# Altium schematic sheet PMTControl.SchDoc
size 297 x 209 mm; SheetNumber: 4; SheetTotal: 4; swcgroup: FabLabs; Org: Sainsbury Wellcome Centre; Add1: 25 Howland Street; Add2: London; Add3: W1T 4JG; WebAddress: www.sainsburywellcome.org; SheetSize: A4; SheetName: PMT Output Level/ Control Input Voltage
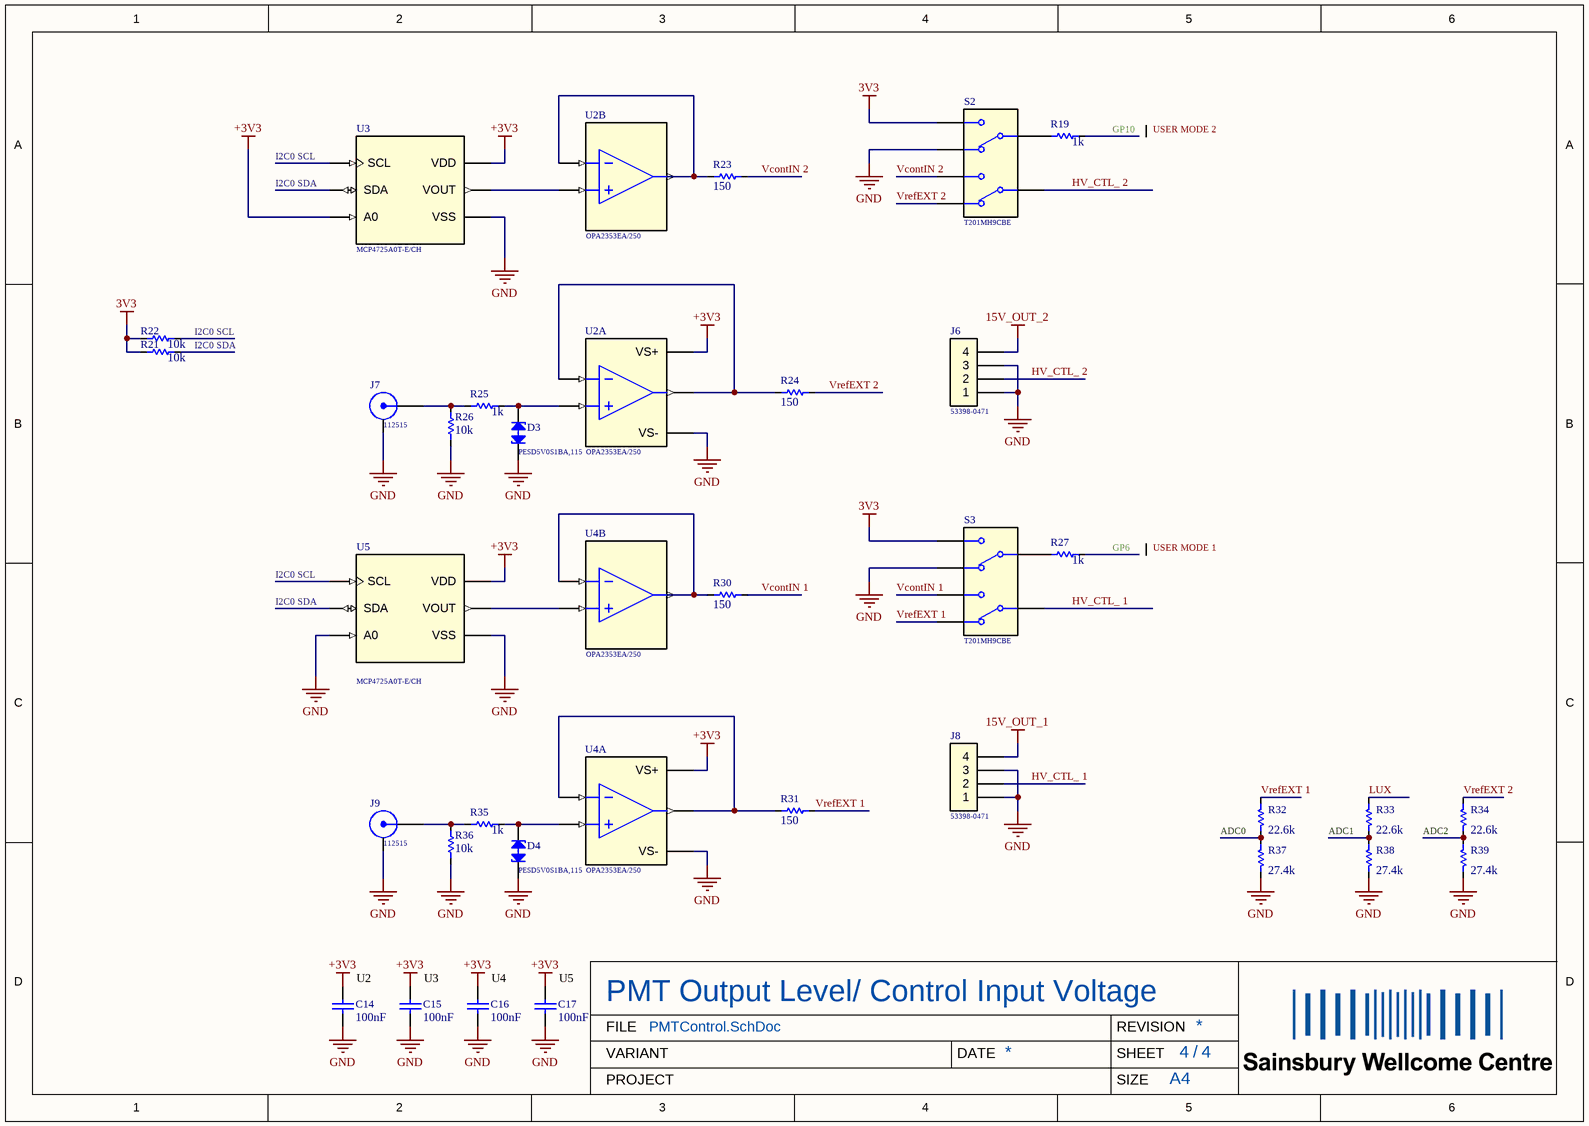
[diagram p0: PMTControl.SchDoc]

## Parts
C14  value 100nF  [FP-GRM188-0_1-e0_2_0_5-IPC_B]  (hidden comment: C0603-100nF-100V-10%-X7R)
C15  value 100nF  [FP-GRM188-0_1-e0_2_0_5-IPC_B]  (hidden comment: C0603-100nF-100V-10%-X7R)
C16  value 100nF  [FP-GRM188-0_1-e0_2_0_5-IPC_B]  (hidden comment: C0603-100nF-100V-10%-X7R)
C17  value 100nF  [FP-GRM188-0_1-e0_2_0_5-IPC_B]  (hidden comment: C0603-100nF-100V-10%-X7R)
D3  PESD5V0S1BA,115  [FP-SOD323-CA-IPC_B]
D4  PESD5V0S1BA,115  [FP-SOD323-CA-IPC_B]
J6  53398-0471  [FP-533980471-MFG]
J7  112515  [AMP_112515]
J8  53398-0471  [FP-533980471-MFG]
J9  112515  [AMP_112515]
R19  value 1k  [FP-CPF0603-IPC_B]  (hidden comment: R0603-1k-1/16W-0.1%)
R21  value 10k  [FP-CPF0603-IPC_B]  (hidden comment: R0603-10k-1/16W-0.1%)
R22  value 10k  [FP-CPF0603-IPC_B]  (hidden comment: R0603-10k-1/16W-0.1%)
R23  value 150  [FP-CPF0603-IPC_B]  (hidden comment: R0603-150R-1/16W-0.1%)
R24  value 150  [FP-CPF0603-IPC_B]  (hidden comment: R0603-150R-1/16W-0.1%)
R25  value 1k  [FP-CPF0603-IPC_B]  (hidden comment: R0603-1k-1/16W-0.1%)
R26  value 10k  [FP-CPF0603-IPC_B]  (hidden comment: R0603-10k-1/16W-0.1%)
R27  value 1k  [FP-CPF0603-IPC_B]  (hidden comment: R0603-1k-1/16W-0.1%)
R30  value 150  [FP-CPF0603-IPC_B]  (hidden comment: R0603-150R-1/16W-0.1%)
R31  value 150  [FP-CPF0603-IPC_B]  (hidden comment: R0603-150R-1/16W-0.1%)
R32  value 22.6k  [FP-CPF0603-IPC_B]  (hidden comment: R0603-22k6-1/16W-0.1%)
R33  value 22.6k  [FP-CPF0603-IPC_B]  (hidden comment: R0603-22k6-1/16W-0.1%)
R34  value 22.6k  [FP-CPF0603-IPC_B]  (hidden comment: R0603-22k6-1/16W-0.1%)
R35  value 1k  [FP-CPF0603-IPC_B]  (hidden comment: R0603-1k-1/16W-0.1%)
R36  value 10k  [FP-CPF0603-IPC_B]  (hidden comment: R0603-10k-1/16W-0.1%)
R37  value 27.4k  [FP-CPF0603-IPC_B]  (hidden comment: R0603-27k4-1/16W-0.1%)
R38  value 27.4k  [FP-CPF0603-IPC_B]  (hidden comment: R0603-27k4-1/16W-0.1%)
R39  value 27.4k  [FP-CPF0603-IPC_B]  (hidden comment: R0603-27k4-1/16W-0.1%)
S2  T201MH9CBE  [SWITCH_T201MH9CBE]
S3  T201MH9CBE  [SWITCH_T201MH9CBE]
U2  OPA2353EA/250  [DGK0008A_N]  (parts A,B of 2)
U3  MCP4725A0T-E/CH  [FP-C04-028-CHY-MFG]
U4  OPA2353EA/250  [DGK0008A_N]  (parts A,B of 2)
U5  MCP4725A0T-E/CH  [FP-C04-028-CHY-MFG]

## Nets
3V3: R21.2 R22.2 S2.1(CHANNEL_A) S3.1(CHANNEL_A)
15V_OUT_1: J8.4
15V_OUT_2: J6.4
+3V3: C14.2 C15.2 C16.2 C17.2 U2.8(VS+) U3.3(VDD) U3.6(A0) U4.8(VS+) U5.3(VDD)
GND: C14.1 C15.1 C16.1 C17.1 D3.1(K1) D4.1(K1) J6.1 J6.3 J7.2(GND) J8.1 J8.3 J9.2(GND) R26.1 R36.1 R37.1 R38.1 R39.1 S2.3(CHANNEL_B) S3.3(CHANNEL_B) U2.4(VS-) U3.2(VSS) U4.4(VS-) U5.2(VSS) U5.6(A0)
ADC0: R32.1 R37.2
ADC1: R33.1 R38.2
ADC2: R34.1 R39.2
GP6: R27.2
GP10: R19.2
HV_CTL_ 1: J8.2 S3.5(COMMON)
HV_CTL_ 2: J6.2 S2.5(COMMON)
I2C0 SCL: R22.1 U3.5(SCL) U5.5(SCL)
I2C0 SDA: R21.1 U3.4(SDA) U5.4(SDA)
LUX: R33.2
VcontIN 1: R30.2 S3.4(CHANNEL_A)
VcontIN 2: R23.2 S2.4(CHANNEL_A)
VrefEXT 1: R31.2 R32.2 S3.6(CHANNEL_B)
VrefEXT 2: R24.2 R34.2 S2.6(CHANNEL_B)
NetD3_2: D3.2(K2) R25.2 U2.3(IN+)
NetD4_2: D4.2(K2) R35.2 U4.3(IN+)
NetJ7_1: J7.1(SIG) R25.1 R26.2
NetJ9_1: J9.1(SIG) R35.1 R36.2
NetR19_1: R19.1 S2.2(COMMON)
NetR23_1: R23.1 U2.6(IN-) U2.7(OUT)
NetR24_1: R24.1 U2.1(OUT) U2.2(IN-)
NetR27_1: R27.1 S3.2(COMMON)
NetR30_1: R30.1 U4.6(IN-) U4.7(OUT)
NetR31_1: R31.1 U4.1(OUT) U4.2(IN-)
NetU2_5: U2.5(IN+) U3.1(VOUT)
NetU4_5: U4.5(IN+) U5.1(VOUT)

## Notes on the sheet
- USER MODE 2
- USER MODE 1
- (near C14) U2
- (near C15) U3
- (near C16) U4
- (near C17) U5
- FILE
- VARIANT
- DATE
- REVISION
- SHEET
- /
- PROJECT
- SIZE

## Library data of the parts
C14-C17 = CMP-611-0027-19: 0.1µF ±10% 100V Ceramic Capacitor X7R 0603 (1608 Metric); Pick&PlaceFootprint: 0603_CAP; Mount: Surface Mount; Voltage Rating: 100V; Min Operating Temperature: -55°C; Termination: SMD/SMT; Width: 0.8mm; Series: GRM; Packaging: Tape and Reel; Size: 0.8mm; Case Code (Metric): 1608; REACH SVHC: No SVHC; Case/Package: 0603; Construction: Flat; Dielectric: X7R; Weight: 0.000222oz; Height: 0.8mm; Tolerance: 10%; Package Quantity: 1; Lead Free: Lead Free; Voltage: 100V; RoHS Compliant: Yes; Capacitance: 100nF; Thickness: 0.035inch; Radiation Hardening: No; Depth: 0.8mm; Length: 1.6mm; Max Operating Temperature: 125°C; Material: Ceramic; Case Code (Imperial): 0603; Voltage Rating (DC): 100V; RoHS: Yes; Capacitor Type: Ceramic
D3 D4 = CMP-820-0001-1: Trans Voltage Suppressor Diode, 130W, 5V V(RWM), Bidirectional, 1 Element, Silicon; Time @ Peak Reflow Temperature-Max (s): 30s; Min Breakdown Voltage: 5.5V; Max Breakdown Voltage: 9.5V; Reference Standard: IEC-60134; Number of Elements: 1; Package Body Material: Plastic; Pick&PlaceFootprint: SOD323; Package Shape: Rectangular; Peak Reflow Temperature (Cel): 260°C; REACH SVHC: Yes; Number of Pins: 2; Terminal Form: Gull Wing; Moisture Sensitivity Level: 1; Non-rep Peak Rev Power Dis-Max: 130W; JESD-609 Code: e3; Terminal Finish: Tin; PartNumber: PESD5V0S1BA,115; RoHS Compliant: Yes; Diode Element Material: SILICON; Rep Pk Reverse Voltage-Max: 5V; Surface Mount: Yes; Terminal Position: DUAL; Mount: Surface Mount; Max Operating Temperature: 150°C; Polarity: Bidirectional; Diode Type: TRANS VOLTAGE SUPPRESSOR; Technology: AVALANCHE; Package Style: SMALL OUTLINEMeter; JESD-30 Code: R-PDSO-G2
J6 J8 = CMP-370-0030-2: Board Connector, 4 Contact(s), 1 Row(s), Male, Straight, 0.049 inch Pitch, Surface Mount Terminal, Locking, Natural Insulator, Receptacle; Polarization Key: POLARIZED HOUSING; Number of Contacts: 4; DIN Conformance: No; Reference Standard: UL; Plating Thickness: 39uin; Mating Information: MULTIPLE MATING PARTS AVAILABLE; Durability: 30Cycles; Body Length: 0.383inch; Contact Pattern: RECTANGULAR; Option: General Purpose; Reliability: COMMERCIAL; Number of Rows Loaded: 1; Dielectric Withstanding Voltage (AC): 250V; Board Mounting Option: FITTING NAIL; Body Breadth: 0.146inch; Contact Resistance: 20mR; Insulation Resistance: 100MR; Rated Current (Signal): 1A; Body Depth: 0.185inch; Contact Style: Blade Pin; Contact Finish - Termination: Matte Tin (Sn) - with Nickel (Ni) barrier; Contact Material: Bronze; Mount: Board; Max Operating Temperature: 85°C; Contact Gender: Male; Connector Type: BOARD CONNECTOR; Termination: SMD/SMT; Mounting Style: STRAIGHT; Insulation Material: Polyamide; Min Operating Temperature: -40°C; IEC Conformance: No; Contact Finish - Mating: MATTE TIN (39) OVER NICKEL; PartNumber: 53398-0471; Filter Feature: No; Body/Shell Style: RECEPTACLE; RoHS Compliant: Yes; MIL Conformance: No; JESD-609 Code: e3; Number Of PCB Rows: 1; Mating Contact Pitch: 0.049inch; Flammability Rating: UL94 V-0; PCB Contact Pattern: RECTANGULAR; Insulation Color: Natural; Number Of Connectors: 1; Mounting Option 1: LOCKING; Mixed Contacts: No; Terminal Pitch: 1.25mm; REACH SVHC: Yes
J7 J9 = CMP-730-0003-6: RF BNC Connector, Female, Board Mount, Solder Terminal, Jack; pin to pad: 2>2+3+4+5; Option: General Purpose; Coupling Type: Bayonet; IEC Conformance: No; Characteristic Impedance: 50R; Panel Mount: No; Contact Gender: Female; PartNumber: 112515; Connector Type: BNC; Insulation Material: POLYTETRAFLUORO; Contact Finish - Mating: NOT SPECIFIED; Termination: Solder; Body/Shell Style: JACK; MIL Conformance: No; REACH SVHC: No SVHC; Filter Feature: No; DIN Conformance: No; RoHS Compliant: Yes; Mounting Style: STRAIGHT; Mount: Board
R19 R25 R27 R35 = CMP-633-0013-15: Surface Mount Resistor 1k Ohm 1/16 W 0.1% 0603 (1608 Metric); Max Power Dissipation: 62.5 mW; Voltage Rating (DC): 50V; Number of Resistors: 1; Power Rating: 62.5mW; Pick&PlaceFootprint: R0603; Temperature Coefficient: 25ppm/°C; Case Code (Imperial): 0603; RoHS Compliant: Yes; Length: 1.6mm; Resistance Tolerance: 0.1%; Technology: Thin Film; REACH SVHC: No SVHC; Termination: Solder; Tolerance: 0.1%; Resistance: 1k; Size Code: 0603; Height: 0.45mm; Case/Package: 0603; Number of Pins: 2; Max Operating Temperature: 155°C; Series: CPF; RoHS: Yes; Weight: 7.1E-05oz; Width: 0.8mm; Case Code (Metric): 1608; Min Operating Temperature: -55°C; ELV: Compliant; Resistor Type: Thin Film; Number of Terminations: 2; Packaging: Tape and Reel; Composition: Thin Film; Voltage Rating: 50V; Mount: Surface Mount
R21 R22 R26 R36 = CMP-633-0002-15: Surface Mount Resistor 10k Ohm 1/16 W 0.1% 0603 (1608 Metric); Pick&PlaceFootprint: R0603; Power Rating: 62.5mW; Voltage Rating (DC): 50V; Number of Resistors: 1; Temperature Coefficient: 25ppm/°C; Max Power Dissipation: 62.5 mW; Height: 0.45mm; Case Code (Imperial): 0603; RoHS: Yes; Composition: Thin Film; Number of Terminations: 2; Case/Package: 0603; Min Operating Temperature: -55°C; ELV: Compliant; Mount: Surface Mount; Packaging: Tape and Reel; Max Operating Temperature: 155°C; Tolerance: 0.1%; Case Code (Metric): 1608; Resistance: 10k; REACH SVHC: No SVHC; Width: 0.8mm; Number of Pins: 2; Voltage Rating: 50V; Length: 1.6mm; Termination: Solder; Weight: 7.1E-05oz; RoHS Compliant: Yes; Size Code: 0603; Series: CPF; Resistance Tolerance: 0.1%; Technology: Thin Film; Resistor Type: Thin Film
R23 R24 R30 R31 = CMP-633-0078-2: Surface Mount Resistor 150 Ohm 1/16 W 0.1% 0603 (1608 Metric); Voltage Rating: 50V; Max Power Dissipation: 62.5 mW; Power Rating: 62.5mW; Number of Resistors: 1; Temperature Coefficient: 25ppm/°C; Pick&PlaceFootprint: R0603; Size Code: 0603; Width: 0.8mm; Number of Pins: 2; Tolerance: 0.1%; Resistance: 150; Construction: Chip; Voltage Rating (DC): 50V; Resistor Type: FIXED RESISTOR; Number of Terminations: 2; Weight: 7.1E-05oz; Min Operating Temperature: -55°C; Length: 1.6mm; Case/Package: 0603; Packaging: Tape and Reel; REACH SVHC: Yes; Height: 0.45mm; Mount: Surface Mount; RoHS Compliant: Yes; ELV: Compliant; Case Code (Metric): 1608; Termination: Wraparound; RoHS: Yes; Case Code (Imperial): 0603; Max Operating Temperature: 155°C; Composition: Thin Film; Resistance Tolerance: 0.1%; Series: CPF; Technology: THIN FILM
R32-R34 = CMP-633-0059-13: Surface Mount Resistor 22.6k Ohm 1/16 W 0.1% 0603 (1608 Metric); Power Rating: 62.5mW; Voltage Rating: 50V; Pick&PlaceFootprint: R0603; Max Power Dissipation: 62.5 mW; Number of Resistors: 1; Temperature Coefficient: 25ppm/°C; RoHS: Yes; Series: CPF; Width: 0.8mm; ELV: Compliant; Resistance: 22.6k; Max Operating Temperature: 155°C; Case Code (Metric): 1608; Voltage Rating (DC): 50V; Composition: Thin Film; Number of Pins: 2; Tolerance: 0.1%; Min Operating Temperature: -55°C; Length: 1.6mm; Height: 0.45mm; Case/Package: 0603; RoHS Compliant: Yes; Termination: Solder; Weight: 7.1E-05oz; Mount: Surface Mount; Packaging: Tape and Reel; Case Code (Imperial): 0603; REACH SVHC: No SVHC; Resistor Type: Thin Film; Number of Terminations: 2; Size Code: 0603; Resistance Tolerance: 0.1%; Technology: Thin Film
R37-R39 = CMP-633-0060-13: Surface Mount Resistor 27.4k Ohm 1/16 W 0.1% 0603 (1608 Metric); Power Rating: 62.5mW; Voltage Rating: 50V; Pick&PlaceFootprint: R0603; Max Power Dissipation: 62.5 mW; Number of Resistors: 1; Temperature Coefficient: 25ppm/°C; Weight: 7.1E-05oz; ELV: Compliant; Number of Pins: 2; Composition: Thin Film; Resistor Type: Thin Film; Number of Terminations: 2; REACH SVHC: No SVHC; Tolerance: 0.1%; Series: CPF; Termination: Solder; Technology: Thin Film; Voltage Rating (DC): 50V; Packaging: Tape and Reel; RoHS: Yes; RoHS Compliant: Yes; Height: 0.45mm; Resistance Tolerance: 0.1%; Case Code (Metric): 1608; Max Operating Temperature: 155°C; Resistance: 27.4k; Case/Package: 0603; Width: 0.8mm; Mount: Surface Mount; Case Code (Imperial): 0603; Min Operating Temperature: -55°C; Length: 1.6mm; Size Code: 0603
S2 S3 = CMP-B00-0010-1: Toggle Switch, DPDT, On-on, Horizontal, 6 PCB Hole Cnt, Solder Terminal, Toggle Bat Actuator, Through Hole-straight; PartNumber: T201MH9CBE; Mount: Through Hole; Case/Package: MH9CBE
U2 U4 = CMP-941-0006-5: Operational Amplifier, 2 Func, 8000uV Offset-Max, CMOS, PDSO8; Pick&PlaceFootprint: TSSOP8; Package Equivalence Code: TSSOP8,.19; PartNumber: OPA2353EA/250
U3 U5 = CMP-9B0-0000-1: DAC 1-CH Resistor-String 12-bit 6-Pin SOT-23A T/R; Resolution: 12b; Input Offset Voltage (Vos): 1.1mV; Interface: I2C,Serial,2-Wire; Number of DAC Channels: 1; Output Polarity: Unipolar; Settling Time: 6us; Supply Current: 210uA; Min Supply Voltage: 2.7V; Input Type: SERIAL; Number of Bits: 12; Max Supply Voltage: 5.5V; Supply Type: Single; Integral Nonlinearity (INL): 14.5LSB; Output Type: Voltage; Termination: SMD/SMT; Number of Converters: 1; Number of Channels: 1; Radiation Hardening: No; Width: 1.8mm; Number of D/A Converters: 1; Max Operating Temperature: 125°C; Length: 3.1mm; Case/Package: SOT-23-6; Contact Plating: Tin,Matte; Number of Outputs: 1; Mount: Surface Mount; REACH SVHC: No SVHC; Height: 1.3mm; Lead Free: Lead Free; Nominal Supply Current: 210uA; Packaging: Tape and Reel; Polarity: Unipolar; Number of Pins: 6; Min Operating Temperature: -40°C; Package Quantity: 3000